# EAGLE design PN532_Breakout_v1.0v2 (EAGLE 5.11)
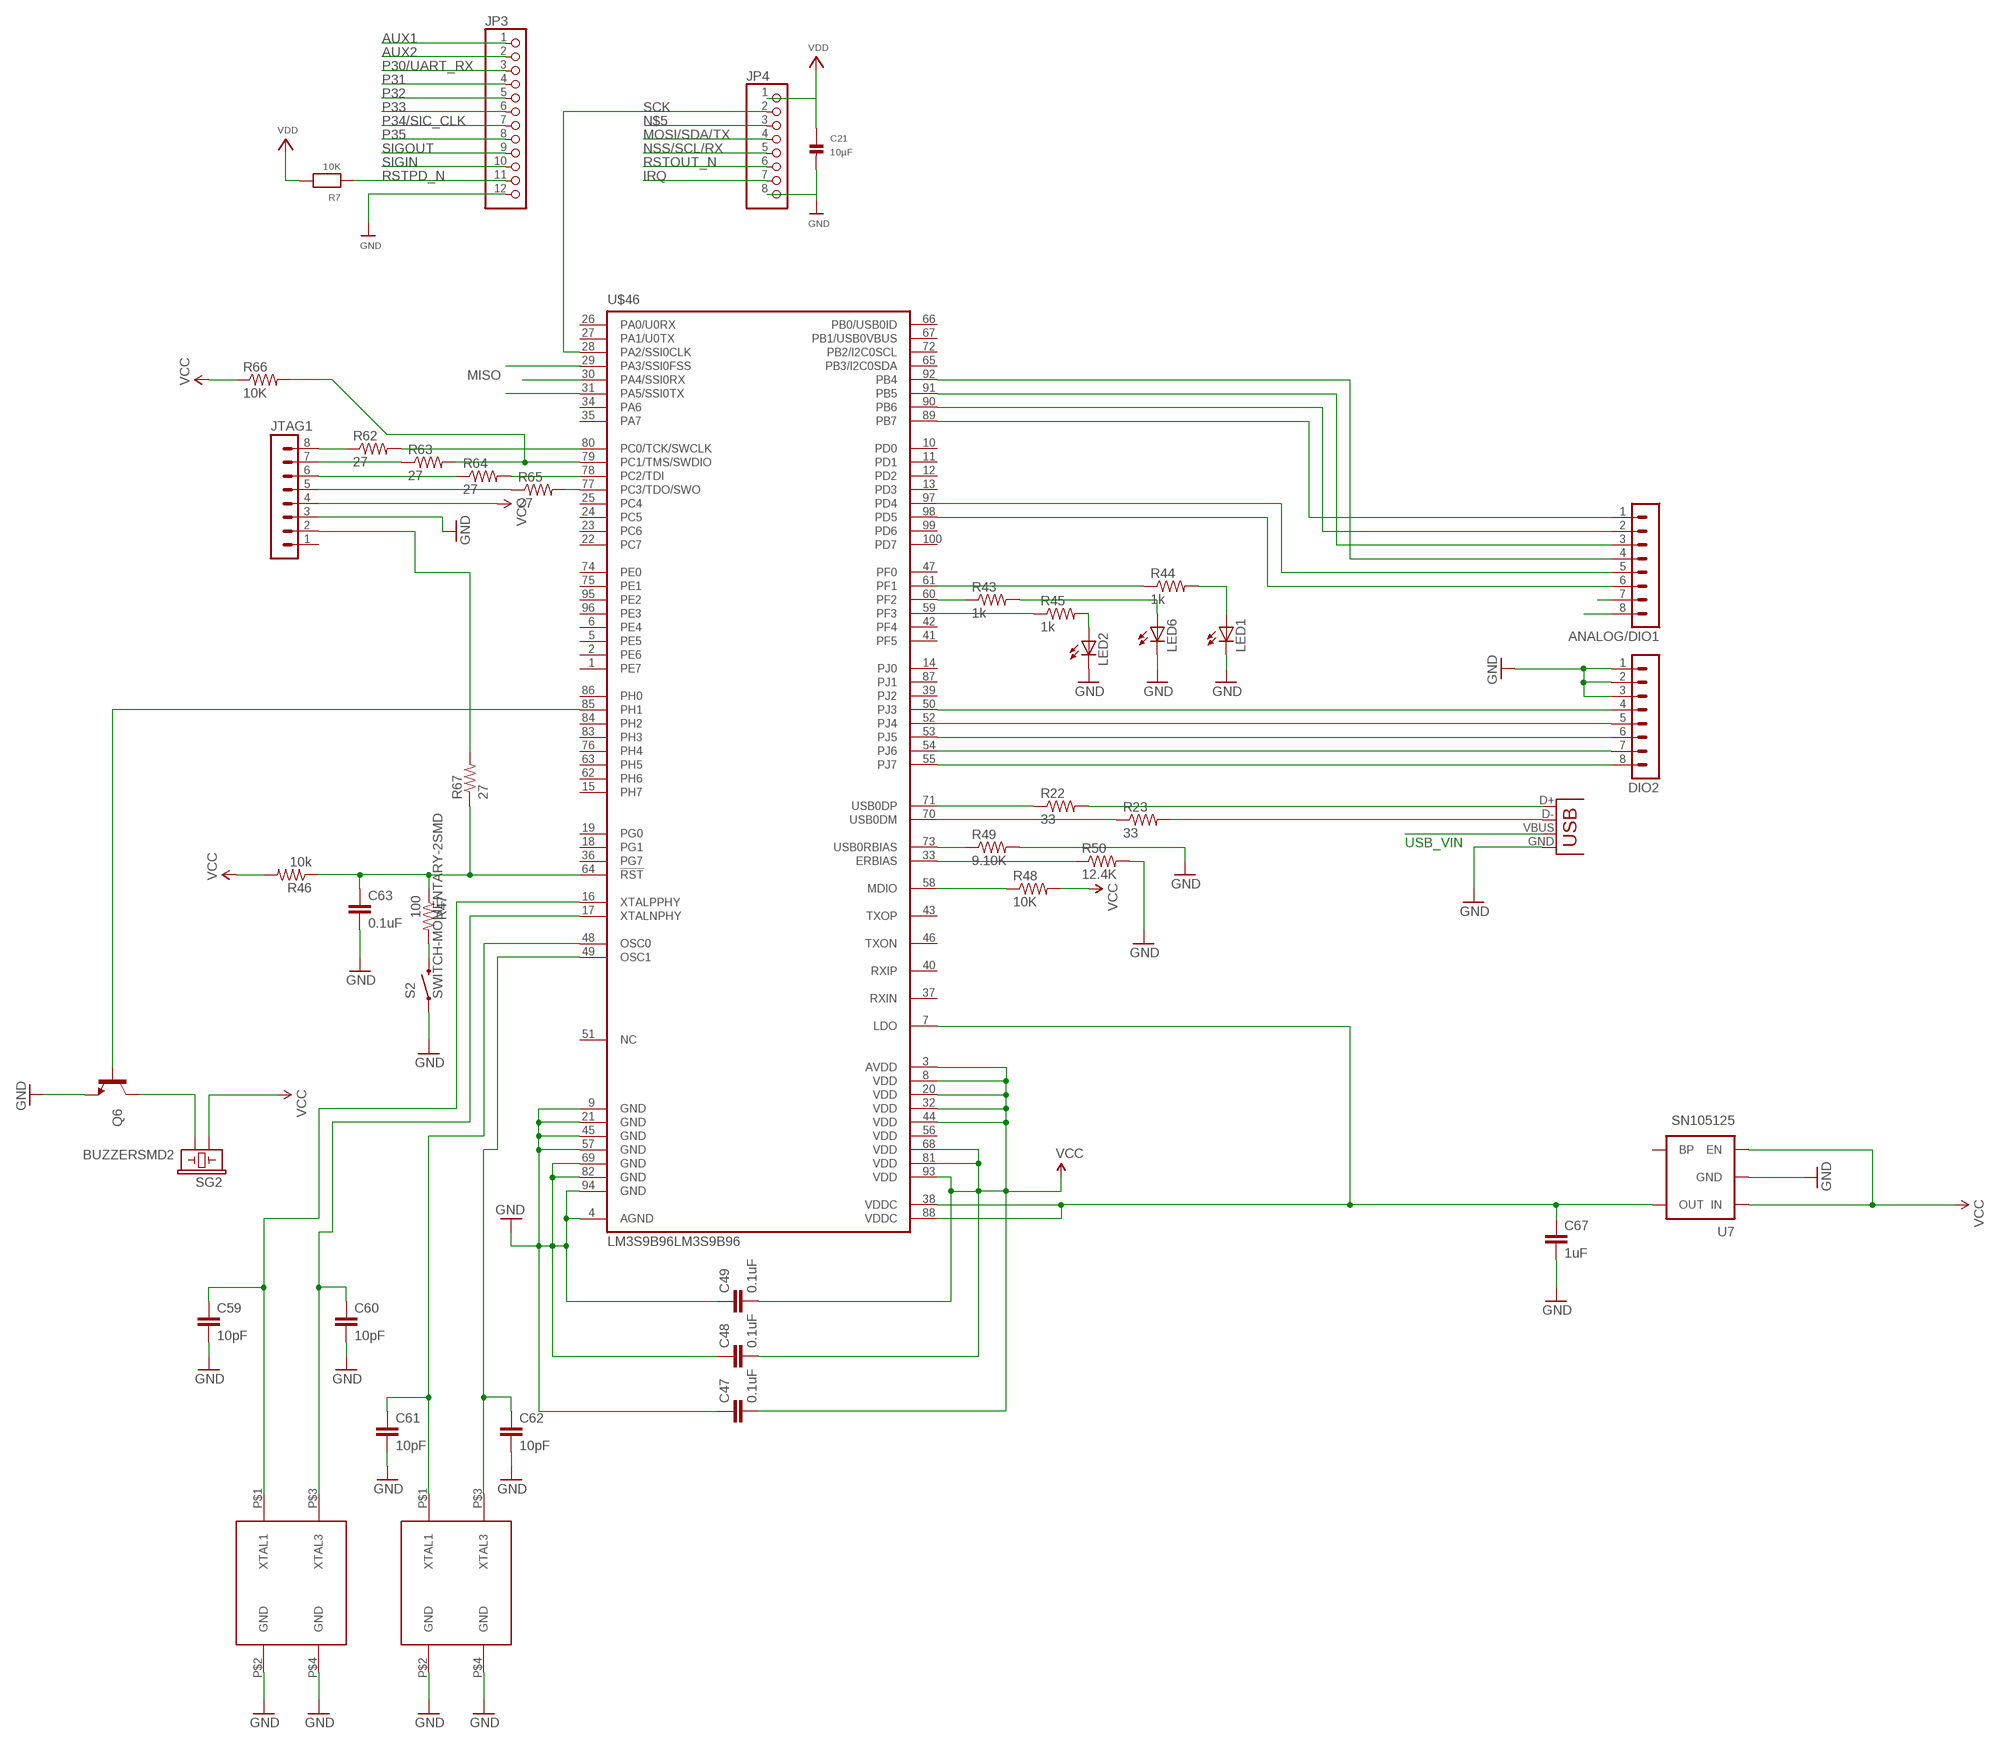
[diagram p0: schematic, sheet 1]

## Parts
16MHZ1  16MHz  ABM3G  [ABM3G]
25MHZ1  25MHz  ABM3G  [ABM3G]
ANALOG/DIO1  MA08-1  [MA08-1]
C21  10µF  CAP_CERAMIC0805  [0805]
C47  0.1uF  CAP0805  [0805]
C48  0.1uF  CAP0805  [0805]
C49  0.1uF  CAP0805  [0805]
C59  10pF  CAP0402-CAP  [0402-CAP]
C60  10pF  CAP0402-CAP  [0402-CAP]
C61  10pF  CAP0402-CAP  [0402-CAP]
C62  10pF  CAP0402-CAP  [0402-CAP]
C63  0.1uF  CAP0402-CAP  [0402-CAP]
C67  1uF  CAP0805  [0805]
DIO2  MA08-1  [MA08-1]
JP3  HEADER-1X12  [1X12_ROUND]
JP4  HEADER-1X8ROUND  [1X08_ROUND]
JTAG1  MA08-1  [MA08-1]
LED1  LED1206  [LED-1206]
LED2  LED1206  [LED-1206]
LED6  LED1206  [LED-1206]
Q6  TRANSISTOR_NPNSOT23  [SOT23]
R7  10K  RESISTOR0603  [0603]
R22  33  RESISTOR  [0805]
R23  33  RESISTOR  [0805]
R43  1k  RESISTOR  [0805]
R44  1k  RESISTOR  [0805]
R45  1k  RESISTOR  [0805]
R46  10k  RESISTOR  [0805]
R47  100  RESISTOR  [0805]
R48  10K  RESISTOR  [0805]
R49  9.10K  RESISTOR  [0805]
R50  12.4K  RESISTOR  [0805]
R62  27  RESISTOR  [0805]
R63  27  RESISTOR  [0805]
R64  27  RESISTOR  [0805]
R65  27  RESISTOR  [0805]
R66  10K  RESISTOR  [0805]
R67  27  RESISTOR  [0805]
S2  SWITCH-MOMENTARY-2SMD  [TACTILE_SWITCH_SMD]
SG2  BUZZERSMD2  [BUZZER-CCV]
U7  SN105125  V_REG_LDOSMD  [SOT23-5]
U$46  LM3S9B96LM3S9B96  [LQFP100]
X1  USBSMD  [USB-MINIB]

## Nets
AUX1: JP3.1
AUX2: JP3.2
GND: 16MHZ1.P$2(GND) 16MHZ1.P$4(GND) 25MHZ1.P$2(GND) 25MHZ1.P$4(GND) C21.2 C47.1 C48.1 C49.1 C59.2 C60.2 C61.2 C62.2 C63.2 C67.2 DIO2.1 DIO2.2 DIO2.3 JP3.12 JP4.8 JTAG1.3 LED1.C LED2.C LED6.C Q6.2(E) R49.2 R50.2 S2.1 U7.2(GND) U$46.4(AGND) U$46.9(GND) U$46.21(GND) U$46.45(GND) U$46.57(GND) U$46.69(GND) U$46.82(GND) U$46.94(GND) X1.GND
IRQ: JP4.7
MOSI/SDA/TX: JP4.4
N$4: U$46.31(PA5/SSI0TX)
N$5: JP4.3
N$6: ANALOG/DIO1.7
N$15: ANALOG/DIO1.8
N$85: LED1.A R44.2
N$86: LED6.A R43.2
N$89: Q6.3(C) SG2.-
N$90: LED2.A R45.2
N$91: R45.1 U$46.59(PF3)
N$92: R43.1 U$46.60(PF2)
N$93: R44.1 U$46.61(PF1)
N$94: C63.1 R46.1 R47.1 R67.1 U$46.64(!RST!)
N$95: Q6.1(B) U$46.85(PH1)
N$96: R22.1 U$46.71(USB0DP)
N$97: R22.2 X1.D+
N$98: R23.2 X1.D-
N$99: R23.1 U$46.70(USB0DM)
N$100: R47.2 S2.3
N$101: R49.1 U$46.73(USB0RBIAS)
N$102: R48.1 U$46.58(MDIO)
N$103: R50.1 U$46.33(ERBIAS)
N$109: 25MHZ1.P$1(XTAL1) C59.1 U$46.16(XTALPPHY)
N$110: 25MHZ1.P$3(XTAL3) C60.1 U$46.17(XTALNPHY)
N$111: 16MHZ1.P$1(XTAL1) C61.1 U$46.48(OSC0)
N$112: 16MHZ1.P$3(XTAL3) C62.1 U$46.49(OSC1)
N$113: DIO2.8 U$46.55(PJ7)
N$114: DIO2.7 U$46.54(PJ6)
N$115: DIO2.6 U$46.53(PJ5)
N$116: DIO2.5 U$46.52(PJ4)
N$117: DIO2.4 U$46.50(PJ3)
N$118: ANALOG/DIO1.6 U$46.98(PD5)
N$119: ANALOG/DIO1.5 U$46.97(PD4)
N$120: ANALOG/DIO1.1 U$46.89(PB7)
N$121: ANALOG/DIO1.2 U$46.90(PB6)
N$122: ANALOG/DIO1.3 U$46.91(PB5)
N$123: ANALOG/DIO1.4 U$46.92(PB4)
N$129: C67.1 U7.5(OUT) U$46.7(LDO) U$46.38(VDDC) U$46.88(VDDC)
N$130: JTAG1.8 R62.1
N$131: R62.2 U$46.80(PC0/TCK/SWCLK)
N$132: R63.2 R66.2 U$46.79(PC1/TMS/SWDIO)
N$133: JTAG1.7 R63.1
N$134: JTAG1.6 R64.1
N$135: R64.2 U$46.78(PC2/TDI)
N$136: R65.2 U$46.77(PC3/TDO/SWO)
N$137: JTAG1.5 R65.1
N$140: JTAG1.2 R67.2
NSS/SCL/RX: JP4.5
P30/UART_RX: JP3.3
P31: JP3.4
P32: JP3.5
P33: JP3.6
P34/SIC_CLK: JP3.7
P35: JP3.8
RSTOUT_N: JP4.6
RSTPD_N: JP3.11 R7.1
SCK: JP4.2 U$46.28(PA2/SSI0CLK)
SIGIN: JP3.10
SIGOUT: JP3.9
USB_VIN1: X1.VBUS
VCC: C47.2 C48.2 C49.2 JTAG1.4 R46.2 R48.2 R66.1 SG2.+ U7.1(IN) U7.3(EN) U$46.3(AVDD) U$46.8(VDD) U$46.20(VDD) U$46.32(VDD) U$46.44(VDD) U$46.68(VDD) U$46.81(VDD) U$46.93(VDD)
VDD: C21.1 JP4.1 R7.2
Unconnected: JTAG1.1 U7.4(BP) U$46.1(PE7) U$46.2(PE6) U$46.5(PE5) U$46.6(PE4) U$46.10(PD0) U$46.11(PD1) U$46.12(PD2) U$46.13(PD3) U$46.14(PJ0) U$46.15(PH7) U$46.18(PG1) U$46.19(PG0) U$46.22(PC7) U$46.23(PC6) U$46.24(PC5) U$46.25(PC4) U$46.26(PA0/U0RX) U$46.27(PA1/U0TX) U$46.29(PA3/SSI0FSS) U$46.30(PA4/SSI0RX) U$46.34(PA6) U$46.35(PA7) U$46.36(PG7) U$46.37(RXIN) U$46.39(PJ2) U$46.40(RXIP) U$46.41(PF5) U$46.42(PF4) U$46.43(TXOP) U$46.46(TXON) U$46.47(PF0) U$46.51(NC) U$46.62(PH6) U$46.63(PH5) U$46.65(PB3/I2C0SDA) U$46.66(PB0/USB0ID) U$46.67(PB1/USB0VBUS) U$46.72(PB2/I2C0SCL) U$46.74(PE0) U$46.75(PE1) U$46.76(PH4) U$46.83(PH3) U$46.84(PH2) U$46.86(PH0) U$46.87(PJ1) U$46.95(PE2) U$46.96(PE3) U$46.99(PD6) U$46.100(PD7)

## Notes on the sheet
- USB_VIN

## Power pins joined to a net without a drawn wire
VDD: U$46.56(VDD)

## Library data of the parts
16MHZ1 25MHZ1 = ABM3G:ABM3G
ANALOG/DIO1 DIO2 JTAG1 = con-lstb:MA08-1: PIN HEADER
C21 = microbuilder:CAP_CERAMIC: Ceramic Capacitors 0402 - 0402 Surface Mount Capacitors 16pF 50V 5% [Digikey: 445-4899-2-ND] 18pF 50V 5% [Digikey: 490-1281-2-ND] 22pF 50V 5% [Digikey: 490-1283-2-ND] 68pF 50V 5% [Digikey: 490-1289-2-ND] 0.1uF 10V 10% [Digikey: 490-1318-2-ND] 0603 - 0603 Surface Mount Capacitors 16 pF 50V 5% [Digikey: 445-5051-2-ND] 22 pF 50V [Digikey: PCC220ACVTR-ND] 33 pF 50V 5% [Digikey: 490-1415-1-ND] 56pF 50V 5% [Digikey: 490-1421-1-ND] 220pF 50V 5% [Digikey: 445-1285-1-ND] 680 pF 50V 2200 pF 50V 5% C0G [Digikey: 445-1297-1-ND] 5600 pF 100V 5% X7R [Digikey: 478-3711-1-ND] 0.1 µF 25V 10% [Digikey: PCC2277TR-ND] 0.22 µF 16V 10% X7R [Digikey: 445-1318-1-ND] 1.0 µF 25V 10% [Digikey: 445-5146-2-ND] 0603 - RF Specific 3pF 250V +/-0.1pF RF [Digikey: 712-1347-1-ND] 18 pF 250V 5% [Digikey: 478-3505-1-ND or 712-1322-1-ND] 56 pF 250V 5% C0G RF [Digikey: 490-4867-1-ND] 68 pF 250V RF [Digikey: 490-4868-1-ND] 0805 - 0805 Surface Mount Capacitors 220 pF 250V 2% RF Ceramic Capacitor [Digikey: 712-1398-1-ND] 1000 pF 50V 2% NP0 Ceramic Capacitor [Digikey: 478-3760-1-ND] 0.1 µF 25V 10% Ceramic Capacitor [Digikey: PCC1828TR-ND] 1.0 µF 16V 10% Ceramic Capacitor[Digikey: 490-1691-2-ND] 10.0 µF 10V 10% Ceramic Capacitor[Digikey: 709-1228-1-ND] 47 uF 6.3V 20% Ceramic Capacitor [Digikey: 399-5506-1-ND] 1206 - 1206 Surface Mount Capacitors 47uF 10V 20% Ceramic Capacitor [Digikey: 399-5508-1-ND]
C47-C49 C59-C63 C67 = SparkFun:CAP: Capacitor Standard 0603 ceramic capacitor, and 0.1" leaded capacitor.
JP3 = microbuilder:HEADER-1X12
JP4 = microbuilder:HEADER-1X8: PIN HEADER
LED1 LED2 LED6 = SparkFun:LED: LEDs Standard schematic elements and footprints for 5mm, 3mm, 1206, and 0603 sized LEDs. 5mm - Spark Fun Electronics SKU : COM-00529 (and others)
Q6 = SparkFun:TRANSISTOR_NPN: Transistor NPN BJT configuration in SOT23 package. MMBT2222 is the common NPN we use. Double check BCE configuration again layout.
R7 = microbuilder:RESISTOR: Resistors 0402 - 0402 Surface Mount Package 22 Ohm 1% 1/16W [Digikey: 311-22.0LRTR-ND] 10.0K 1% 1/16W [Digikey: 311-10.0KLRTR-ND] 10.0K 5% 1/16W [Digikey: RMCF0402JT10K0TR-ND] 12.1K 1% 1/16W [Digikey: 311-22.0LRTR-ND] 0603 - 0603 Surface Mount Package 0 Ohm 1/10 Watt 1% Resistor 15 Ohm 1/10 Watt 1% Resistor 33 Ohm 1/10 Watt 1% Resistor 49.9 Ohm 1/10 Watt 1% Resistor 100 Ohm 1/10 Watt 1% Resistor 150 Ohm 1/10 Watt 1% Resistor 240 Ohm 1/10 Watt 1% Resistor 390 Ohm 1/10 Watt 1% Resistor 560 Ohm 1/10 Watt 1% Resistor 750 Ohm 1/10 Watt 1% Resistor 1.0K Ohm 1/10 Watt 1% Resistor 1.5K Ohm 1/10 Watt 1% Resistor 2.0K Ohm 1/10 Watt 1% Resistor 4.7K Ohm 1/10 Watt 1% Resistor 10.0K Ohm 1/10 Watt 1% Resistor 20.0K Ohm 1/10 Watt 1% Resistor 33.0K Ohm 1/10 Watt 1% Resistor 100.0K Ohm 1/10 Watt 1% Resistor 0805 - 0805 Surface Mount Package 0 Ohm 1/8 Watt 1% Resistor 33 Ohm 1/8 Watt 1% Resistor 100 Ohm 1/8 Watt 1% Resistor 150 Ohm 1/8 Watt 1% Resistor 200 Ohm 1/8 Watt 1% Resistor 240 Ohm 1/8 Watt 1% Resistor 330 Ohm 1/8 Watt 1% Resistor 390 Ohm 1/8 Watt 1% Resistor 470 Ohm 1/8 Watt 1% Resistor 1.0K Ohm 1/8 Watt 1% Resistor 1.5K Ohm 1/8 Watt 1% Resistor 2.0K Ohm 1/8 Watt 1% Resistor 4.7K Ohm 1/8 Watt 1% Resistor 5.1K Ohm 1/8 Watt 1% Resistor 5.6K Ohm 1/8 Watt 1% Resistor 10.0K Ohm 1/8 Watt 1% Resistor 22.0K Ohm 1/8 Watt 1% Resistor 33.0K Ohm 1/8 Watt 1% Resistor 100K Ohm 1/8 Watt 1% Resistor 1206 - 1206 Surface Mount Package
R22 R23 R43-R50 R62-R67 = SparkFun:RESISTOR: Resistor Basic schematic elements and footprints for 0603, 1206, and PTH 1/10th watt (small) resistors.
S2 = SparkFun:SWITCH-MOMENTARY-2
SG2 = SparkFun:BUZZER: Buzzer 12mm Spark Fun Electronics SKU : Comp-Buzzer
U7 = SparkFun:V_REG_LDO: Voltage Regulator LDO Standard 150mA LDO voltage regulator in SOT-23 layout. Micrel part MIC5205. BP (by-pass) pin is used to lower output noise with 470pF cap.
U$46 = luminary-arm:LM3S9B96
X1 = SparkFun:USB: USB Connectors USB-B-PTH is fully proven SKU : PRT-00139 USB-miniB is fully proven SKU : PRT-00587 USB-A-PCB is untested. USB-A-H is throughly reviewed, but untested. Spark Fun Electronics SKU : PRT-00437 USB-B-SMT is throughly reviewed, but untested. Needs silkscreen touching up. USB-A-S has not been used/tested USB-MB-H has not been used/tested

## Board
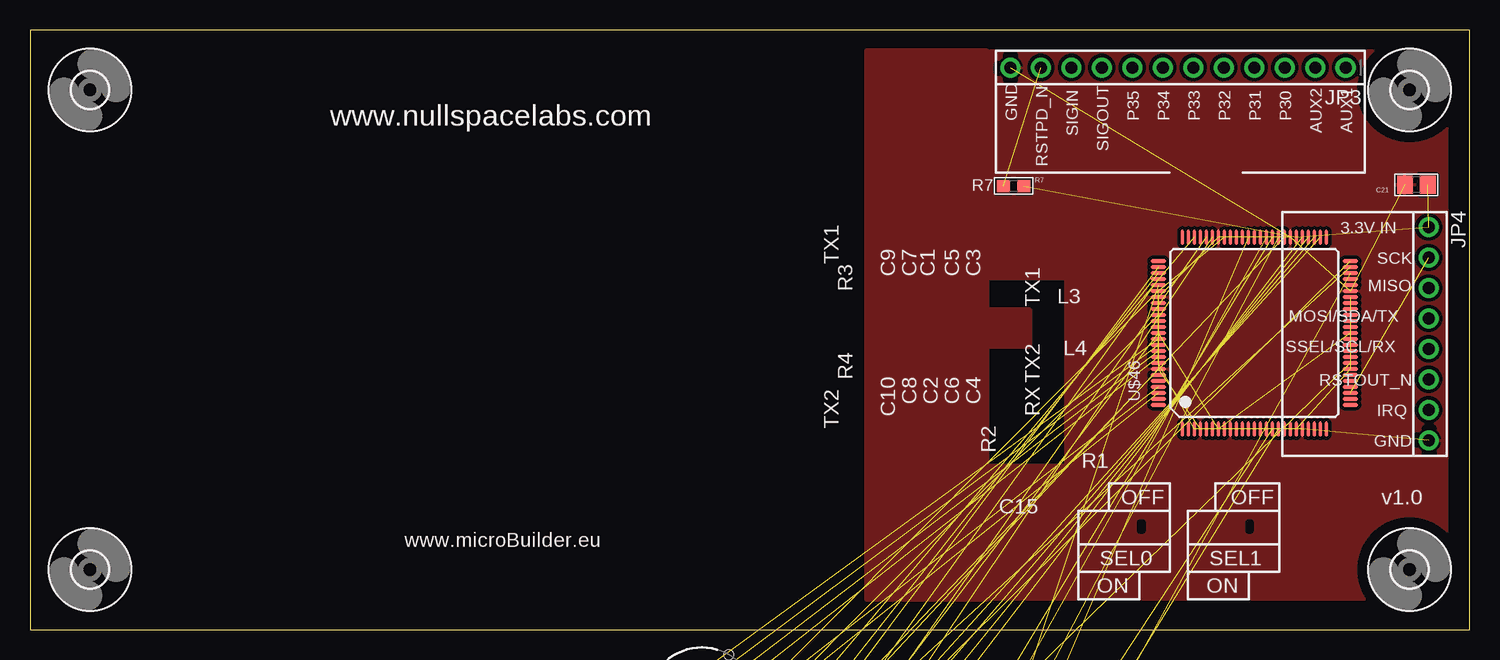
[diagram p1: board, top side]
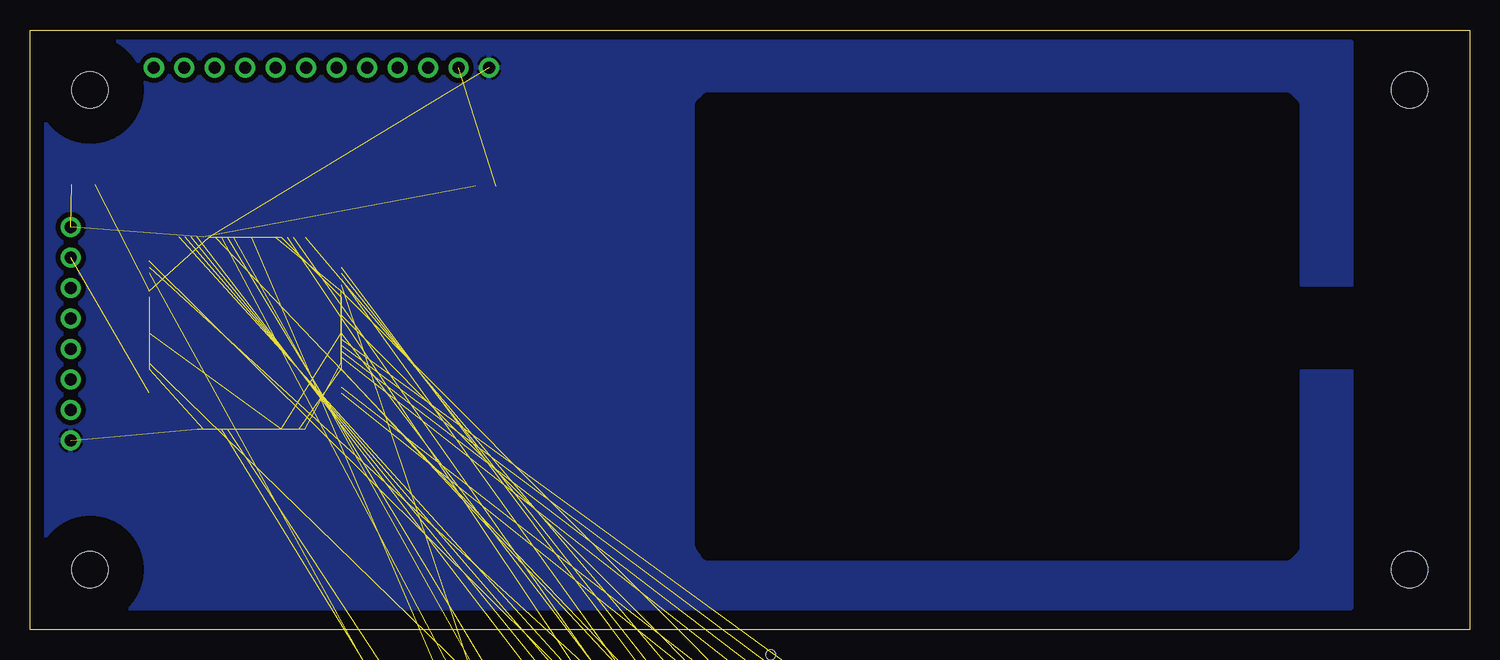
[diagram p2: board, bottom side, seen from below]

Size 120 x 50 mm. Coordinates in mm from the lower left corner, seen from the top.
Outline: 0,0 120,0 120,50 0,50 0,0
Copper layers (1*16): Top 0.035mm / dielectric 1.5mm / Bottom 0.035mm
Design rules "PCBCart-Standard": minimum track width 8mil, minimum drill 0.4mm, track to track 8mil, track to pad 8mil, pad to pad 8mil, via to via 8mil, smd to smd 8mil, copper to edge 20mil, drill to drill 8mil, minimum pad ring 8mil, minimum via ring 10mil, stop-mask expansion 3mil, vias tented up to drill 0mil, thermal gap 8mil
tRestrict: area 81.4,47.8 to 82,47.9; area 81.4,45.8 to 82,46; area 80.6,46.5 to 80.8,47.1; area 116.3,16.6 to 117,16.8; area 116.3,14.7 to 117,14.9; area 115.6,15.5 to 115.7,16.1; area 101.6,8.3 to 101.7,8.9; area 92.6,8.3 to 92.7,8.9
bRestrict: area 14.7,6.3 to 64,44.2; area 9.1,26.9 to 14.2,28.2; area 9.1,22.1 to 14.2,23.4

### Footprints (pad centres in the part's own frame; a part is rotated, then mirrored left to right if it is on the bottom)
ABM3G = smd 1.8 x 1.2: P$1 2,1.2; P$2 -2,1.2; P$3 -2,-1.2; P$4 2,-1.2
MA08-1 = drill 1.016 long: 1 -8.89,0; 2 -6.35,0; 3 -3.81,0; 4 -1.27,0; 5 1.27,0; 6 3.81,0; 7 6.35,0; 8 8.89,0
0805 = smd 1.3 x 1.5: 1 -0.95,0; 2 0.95,0
0805' = smd 0.8 x 1.2: 1 -0.9,0; 2 0.9,0
0402-CAP = smd 0.7 x 0.9: 1 -0.65,0; 2 0.65,0
1X12_ROUND = drill 1 pad 1.676 round: 1 -13.97,0; 2 -11.43,0; 3 -8.89,0; 4 -6.35,0; 5 -3.81,0; 6 -1.27,0; 7 1.27,0; 8 3.81,0; 9 6.35,0; 10 8.89,0; 11 11.43,0; 12 13.97,0
1X08_ROUND = drill 1 pad 1.676 round: 1 -8.89,0; 2 -6.35,0; 3 -3.81,0; 4 -1.27,0; 5 1.27,0; 6 3.81,0; 7 6.35,0; 8 8.89,0
LED-1206 = smd 1.2 x 1.4: A -1.5,0; C 1.5,0
SOT23 = smd 1 x 1.4: 1 -0.95,-1.1; 2 0.95,-1.1; 3 0,1.1
0603 = smd 1.1 x 1: 1 -0.85,0; 2 0.85,0
TACTILE_SWITCH_SMD = smd 1.524 x 0.762: 1 -2.54,1.905; 2 2.54,1.905; 3 -2.54,-1.905; 4 2.54,-1.905
BUZZER-CCV = smd 3.2 x 2.5: + 4,0; - -4,0 | hole 0.8: -3.9,-2.25; 2.25,3.9
SOT23-5 = smd 0.55 x 1.2: 1 -0.95,-1.3; 2 0,-1.3; 3 0.95,-1.3; 4 0.95,1.3; 5 -0.95,1.3
MOUNTINGHOLE_3.0 = hole 3: 0,0
LQFP100 = smd 0.3 x 1.25: 1 -6,-8; 2 -5.5,-8; 3 -5,-8; 4 -4.5,-8; 5 -4,-8; 6 -3.5,-8; 7 -3,-8; 8 -2.5,-8; 9 -2,-8; 10 -1.5,-8; 11 -1,-8; 12 -0.5,-8; 13 0,-8; 14 0.5,-8; 15 1,-8; 16 1.5,-8; 17 2,-8; 18 2.5,-8; 19 3,-8; 20 3.5,-8; 21 4,-8; 22 4.5,-8; 23 5,-8; 24 5.5,-8; 25 6,-8; 51 6,8; 52 5.5,8; 53 5,8; 54 4.5,8; 55 4,8; 56 3.5,8; 57 3,8; 58 2.5,8; 59 2,8; 60 1.5,8; 61 1,8; 62 0.5,8; 63 0,8; 64 -0.5,8; 65 -1,8; 66 -1.5,8; 67 -2,8; 68 -2.5,8; 69 -3,8; 70 -3.5,8; 71 -4,8; 72 -4.5,8; 73 -5,8; 74 -5.5,8; 75 -6,8 | smd 1.25 x 0.3: 26 8,-6; 27 8,-5.5; 28 8,-5; 29 8,-4.5; 30 8,-4; 31 8,-3.5; 32 8,-3; 33 8,-2.5; 34 8,-2; 35 8,-1.5; 36 8,-1; 37 8,-0.5; 38 8,0; 39 8,0.5; 40 8,1; 41 8,1.5; 42 8,2; 43 8,2.5; 44 8,3; 45 8,3.5; 46 8,4; 47 8,4.5; 48 8,5; 49 8,5.5; 50 8,6; 76 -8,6; 77 -8,5.5; 78 -8,5; 79 -8,4.5; 80 -8,4; 81 -8,3.5; 82 -8,3; 83 -8,2.5; 84 -8,2; 85 -8,1.5; 86 -8,1; 87 -8,0.5; 88 -8,0; 89 -8,-0.5; 90 -8,-1; 91 -8,-1.5; 92 -8,-2; 93 -8,-2.5; 94 -8,-3; 95 -8,-3.5; 96 -8,-4; 97 -8,-4.5; 98 -8,-5; 99 -8,-5.5; 100 -8,-6
USB-MINIB = smd 2.5 x 0.5: D+ 2.5,0; D- 2.5,0.8; GND 2.5,-1.6; ID 2.5,-0.8; VBUS 2.5,1.6 | smd 2.5 x 2: GND@1 -3,-4.5; GND@2 -3,4.5; GND@3 2.5,4.5; GND@4 2.5,-4.5 | hole 0.9: 0,2.2; 0,-2.2

### Placement (x,y rotation side)
16MHZ1  12,-60 0 top  (outside the outline)
25MHZ1  19,-60 0 top  (outside the outline)
ANALOG/DIO1  23,-34 0 top  (outside the outline)
C21  115.57,37.08 180 top
C47  0.1uF  [0805']  2,-66 0 top  (outside the outline)
C48  0.1uF  [0805']  6,-66 0 top  (outside the outline)
C49  0.1uF  [0805']  10,-66 0 top  (outside the outline)
C59  50,-66 0 top  (outside the outline)
C60  54,-66 0 top  (outside the outline)
C61  58,-66 0 top  (outside the outline)
C62  2,-71 0 top  (outside the outline)
C63  6,-71 0 top  (outside the outline)
C67  1uF  [0805']  22,-71 0 top  (outside the outline)
DIO2  46,-34 0 top  (outside the outline)
JP3  95.7,46.87 180 top
JP4  116.59,24.67 270 top
JTAG1  12,-46 0 top  (outside the outline)
LED1  45,-60 0 top  (outside the outline)
LED2  52,-60 0 top  (outside the outline)
LED6  59,-60 0 top  (outside the outline)
Q6  7,-61 0 top  (outside the outline)
R7  82,37 0 top
R22  33  [0805']  26,-71 0 top  (outside the outline)
R23  33  [0805']  30,-71 0 top  (outside the outline)
R43  1k  [0805']  42,-71 0 top  (outside the outline)
R44  1k  [0805']  46,-71 0 top  (outside the outline)
R45  1k  [0805']  50,-71 0 top  (outside the outline)
R46  10k  [0805']  54,-71 0 top  (outside the outline)
R47  100  [0805']  58,-71 0 top  (outside the outline)
R48  10K  [0805']  2,-76 0 top  (outside the outline)
R49  9.10K  [0805']  6,-76 0 top  (outside the outline)
R50  12.4K  [0805']  10,-76 0 top  (outside the outline)
R62  27  [0805']  58,-76 0 top  (outside the outline)
R63  27  [0805']  2,-81 0 top  (outside the outline)
R64  27  [0805']  6,-81 0 top  (outside the outline)
R65  27  [0805']  10,-81 0 top  (outside the outline)
R66  10K  [0805']  14,-81 0 top  (outside the outline)
R67  27  [0805']  18,-81 0 top  (outside the outline)
S2  21,-54 0 top  (outside the outline)
SG2  56,-6 0 top
U7  2,-61 0 top  (outside the outline)
U$6  [MOUNTINGHOLE_3.0]  5,45 0 top
U$36  [MOUNTINGHOLE_3.0]  5,5 0 top
U$37  [MOUNTINGHOLE_3.0]  115,5 0 top
U$38  [MOUNTINGHOLE_3.0]  115,45 0 top
U$46  102.07,24.72 0 top
X1  7,-36 0 top  (outside the outline)

### Tracks (layer width: path | path; a pad name or v marks a point on that pad's centre or on a via)
GND  (36 unrouted)
  pour Top (isolate 0.305): 80.01,48.26 118.11,48.26 118.11,2.54 80.01,2.54 80.01,13.72 86.36,13.72 86.36,29.21 80.01,29.21
  pour Top (isolate 0.406): 69.72,48.26 79.76,48.26 79.76,2.54 69.72,2.54
  pour Top (isolate 0.406): 80.01,26.67 83.31,26.67 83.31,23.62 80.01,23.62
  pour Bottom (isolate 0.406): 9.91,1.78 118.62,1.78 118.62,49.02 9.91,49.02
N$85  (1 unrouted)
N$86  (1 unrouted)
N$89  (1 unrouted)
N$90  (1 unrouted)
N$91  (1 unrouted)
N$92  (1 unrouted)
N$93  (1 unrouted)
N$94  (4 unrouted)
N$95  (1 unrouted)
N$96  (1 unrouted)
N$97  (1 unrouted)
N$98  (1 unrouted)
N$99  (1 unrouted)
N$100  (1 unrouted)
N$101  (1 unrouted)
N$102  (1 unrouted)
N$103  (1 unrouted)
N$109  (2 unrouted)
N$110  (2 unrouted)
N$111  (2 unrouted)
N$112  (2 unrouted)
N$113  (1 unrouted)
N$114  (1 unrouted)
N$115  (1 unrouted)
N$116  (1 unrouted)
N$117  (1 unrouted)
N$118  (1 unrouted)
N$119  (1 unrouted)
N$120  (1 unrouted)
N$121  (1 unrouted)
N$122  (1 unrouted)
N$123  (1 unrouted)
N$129  (4 unrouted)
N$130  (1 unrouted)
N$131  (1 unrouted)
N$132  (2 unrouted)
N$133  (1 unrouted)
N$134  (1 unrouted)
N$135  (1 unrouted)
N$136  (1 unrouted)
N$137  (1 unrouted)
N$140  (1 unrouted)
RSTPD_N  (1 unrouted)
SCK  (1 unrouted)
VCC  (17 unrouted)
VDD  (3 unrouted)

### Text on the board
tPlace: www.nullspacelabs.com | GND | P35 | P34 | P33 | P32 | P31 | P30 | SIGIN | AUX2 | AUX1 | SIGOUT | RSTPD_N | R7 | 3.3V IN | TX1 | SCK | C9 | C7 | C1 | C5 | C3 | R3 | MISO | TX1 | L3 | MOSI/SDA/TX | L4 | SSEL/SCL/RX | R4 | TX2 | RSTOUT_N | C8 | C2 | C6 | C4 | C10 | RX | IRQ | TX2 | R2 | GND | R1 | C15 | OFF | OFF | v1.0 | www.microBuilder.eu | SEL0 | SEL1 | ON | ON